# EAGLE design Boom_Control_Board (EAGLE 9.5.2)
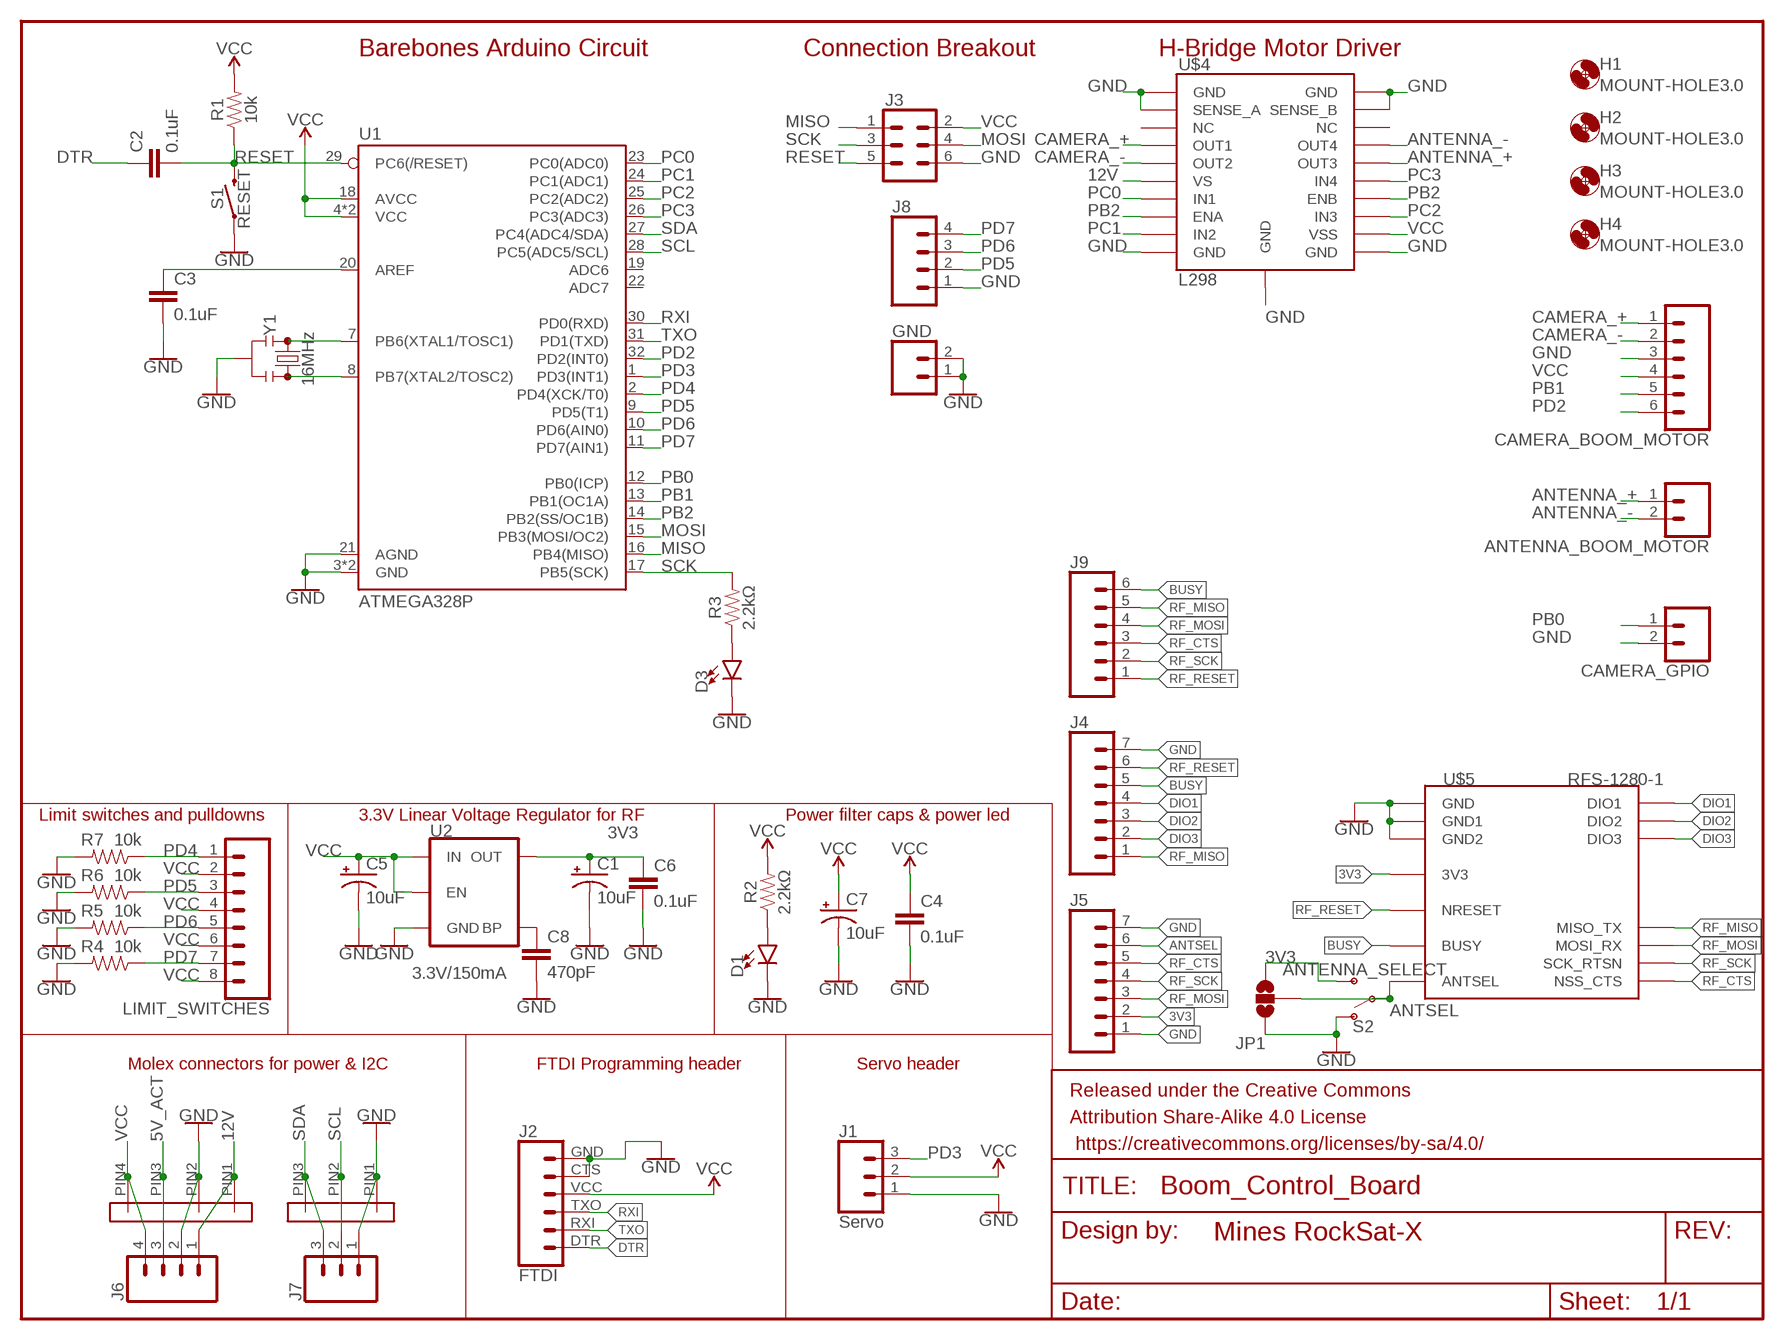
[diagram p0: schematic, sheet 1]

## Parts
ANTENNA_BOOM_MOTOR  CONN_02LOCK_LONGPADS  [1X02_LOCK_LONGPADS]
C1  10uF  10UF-POLAR-EIA3216-16V-10%(TANT)  [EIA3216]
C2  0.1uF  2.2UF-0805-25V-(+80/-20%)  [0805]
C3  0.1uF  2.2UF-0805-25V-(+80/-20%)  [0805]
C4  0.1uF  2.2UF-0805-25V-(+80/-20%)  [0805]
C5  10uF  10UF-POLAR-EIA3216-16V-10%(TANT)  [EIA3216]
C6  0.1uF  2.2UF-0805-25V-(+80/-20%)  [0805]
C7  10uF  10UF-POLAR-EIA3216-16V-10%(TANT)  [EIA3216]
C8  470pF  CAP-0805  [0805]
CAMERA_BOOM_MOTOR  CONN_06LOCK_LONGPADS  [1X06_LOCK_LONGPADS]
CAMERA_GPIO  CONN_02LOCK_LONGPADS  [1X02_LOCK_LONGPADS]
D1  LED-GREEN1206  [LED-1206]
D3  LED-GREEN1206  [LED-1206]
FRAME1  FRAME-LETTERNO_PACKAGE  [DUMMY]
GND  CONN_02LOCK_LONGPADS  [1X02_LOCK_LONGPADS]
H1  MOUNT-HOLE3.0  [3,0]
H2  MOUNT-HOLE3.0  [3,0]
H3  MOUNT-HOLE3.0  [3,0]
H4  MOUNT-HOLE3.0  [3,0]
J1  Servo  CONN_03  [1X03]
J2  FTDI  6_PIN_SERIAL_CABLEPTH  [FTDI_BASIC]
J3  CONN_03X22X3_SILK_MALE_PTH  [2X3]
J4  CONN_07LOCK  [1X07_LOCK]
J5  CONN_07LOCK  [1X07_LOCK]
J6  CONN_04LOCK  [1X04_LOCK]
J7  CONN_03  [1X03]
J8  CONN_04LOCK  [1X04_LOCK]
J9  CONN_06LOCK  [1X06_LOCK]
JP1  JUMPER-SMT_3_NO_NO_SILK  [SMT-JUMPER_3_0-NO_TRACE_NO-SILK]
LIMIT_SWITCHES  CONN_08LOCK_LONGPADS  [1X08_LOCK_LONGPADS]
R1  10k  RESISTOR0805  [0805]
R2  2.2kΩ  RESISTOR0805  [0805]
R3  2.2kΩ  RESISTOR0805  [0805]
R4  10k  RESISTOR0805  [0805]
R5  10k  RESISTOR0805  [0805]
R6  10k  RESISTOR0805  [0805]
R7  10k  RESISTOR0805  [0805]
S1  RESET  MOMENTARY-SWITCH-SPST-SMD-5.2-REDUNDANT  [TACTILE_SWITCH_SMD_5.2MM]
S2  ANTENNA_SELECT  SWITCH-SPDT-PTH-11.6X4.0MM  [SWITCH_SPDT_PTH_11.6X4.0MM]
U1  ATMEGA328P  ATMEGA328P_TQFP  [TQFP32-08]
U2  3.3V/150mA  V_REG_MIC52053.3V  [SOT23-5]
U$1  MOLEX_4PIN  [MOLEX_4PIN]
U$2  MOLEX_3PIN  [MOLEX_3PIN]
U$4  L298  L298_SMD_W_PAD  [POWERSO20_L298_PAD]
U$5  RFS-1280-1  [RFS-1280-1]
Y1  16MHz  RESONATOR-16MHZSMD_3.2X1.3  [RESONATOR-SMD-3.2X1.3]

## Nets
3V3: C1.+ C6.1 J5.2 JP1.3 S2.3(S) U2.5(OUT) U$5.P$9(3V3) U$5.P$23(3V3)
5V_ACT: J6.3 U$1.PIN3
12V: J6.1 U$1.PIN1 U$4.6(VS)
ANTENNA_+: ANTENNA_BOOM_MOTOR.1 U$4.16(OUT3)
ANTENNA_-: ANTENNA_BOOM_MOTOR.2 U$4.17(OUT4)
ANTSEL: J5.6 JP1.2 S2.2(P) U$5.P$13(ANTSEL) U$5.P$27(ANTSEL)
BUSY: J4.5 J9.6 U$5.P$3(BUSY) U$5.P$17(BUSY)
CAMERA_+: CAMERA_BOOM_MOTOR.1 U$4.4(OUT1)
CAMERA_-: CAMERA_BOOM_MOTOR.2 U$4.5(OUT2)
DIO1: J4.4 U$5.P$4(DIO1) U$5.P$18(DIO1)
DIO2: J4.3 U$5.P$5(DIO2) U$5.P$19(DIO2)
DIO3: J4.2 U$5.P$6(DIO3) U$5.P$20(DIO3)
DTR: C2.1 J2.DTR
GND: C1.- C3.2 C4.2 C5.- C6.2 C7.- C8.2 CAMERA_BOOM_MOTOR.3 CAMERA_GPIO.2 D1.C D3.C GND.1 GND.2 J1.1 J2.CTS J2.GND J3.6 J4.7 J5.1 J5.7 J6.2 J7.1 J8.1 JP1.1 R4.2 R5.2 R6.2 R7.2 S1.1 S1.2 S2.1(O) U1.3(GND) U1.5(GND) U1.21(AGND) U2.2(GND) U$1.PIN2 U$2.PIN1 U$4.1(GND) U$4.2(SENSE_A) U$4.10(GND) U$4.11(GND) U$4.19(SENSE_B) U$4.20(GND) U$4.PAD(GND) U$5.P$1(GND) U$5.P$8(GND1) U$5.P$14(GND2) U$5.P$15(GND) U$5.P$22(GND1) U$5.P$28(GND2) Y1.2
MISO: J3.1 U1.16(PB4(MISO))
MOSI: J3.4 U1.15(PB3(MOSI/OC2))
N$2: U1.7(PB6(XTAL1/TOSC1)) Y1.1
N$3: U1.8(PB7(XTAL2/TOSC2)) Y1.3
N$4: C3.1 U1.20(AREF)
N$5: D1.A R2.1
N$7: D3.A R3.1
N$8: C8.1 U2.4(BP)
PB0: CAMERA_GPIO.1 U1.12(PB0(ICP))
PB1: CAMERA_BOOM_MOTOR.5 U1.13(PB1(OC1A))
PB2: U1.14(PB2(SS/OC1B)) U$4.8(ENA) U$4.14(ENB)
PC0: U1.23(PC0(ADC0)) U$4.7(IN1)
PC1: U1.24(PC1(ADC1)) U$4.9(IN2)
PC2: U1.25(PC2(ADC2)) U$4.13(IN3)
PC3: U1.26(PC3(ADC3)) U$4.15(IN4)
PD2: CAMERA_BOOM_MOTOR.6 U1.32(PD2(INT0))
PD3: J1.3 U1.1(PD3(INT1))
PD4: LIMIT_SWITCHES.1 R7.1 U1.2(PD4(XCK/T0))
PD5: J8.2 LIMIT_SWITCHES.3 R6.1 U1.9(PD5(T1))
PD6: J8.3 LIMIT_SWITCHES.5 R5.1 U1.10(PD6(AIN0))
PD7: J8.4 LIMIT_SWITCHES.7 R4.1 U1.11(PD7(AIN1))
RESET: C2.2 J3.5 R1.1 S1.3 S1.4 U1.29(PC6(/RESET))
RF_CTS: J5.5 J9.3 U$5.P$12(NSS_CTS) U$5.P$26(NSS_CTS)
RF_MISO: J4.1 J9.5 U$5.P$7(MISO_TX) U$5.P$21(MISO_TX)
RF_MOSI: J5.3 J9.4 U$5.P$10(MOSI_RX) U$5.P$24(MOSI_RX)
RF_RESET: J4.6 J9.1 U$5.P$2(NRESET) U$5.P$16(NRESET)
RF_SCK: J5.4 J9.2 U$5.P$11(SCK_RTSN) U$5.P$25(SCK_RTSN)
RXI: J2.TXO U1.30(PD0(RXD))
SCK: J3.3 R3.2 U1.17(PB5(SCK))
SCL: J7.2 U1.28(PC5(ADC5/SCL)) U$2.PIN2
SDA: J7.3 U1.27(PC4(ADC4/SDA)) U$2.PIN3
TXO: J2.RXI U1.31(PD1(TXD))
VCC: C4.1 C5.+ C7.+ CAMERA_BOOM_MOTOR.4 J1.2 J2.VCC J3.2 J6.4 LIMIT_SWITCHES.2 LIMIT_SWITCHES.4 LIMIT_SWITCHES.6 LIMIT_SWITCHES.8 R1.2 R2.2 U1.4(VCC) U1.6(VCC) U1.18(AVCC) U2.1(IN) U2.3(EN) U$1.PIN4 U$4.12(VSS)
Unconnected: U1.19(ADC6) U1.22(ADC7) U$4.3(NC) U$4.18(NC)

## Notes on the sheet
- Barebones Arduino Circuit | Connection Breakout | H-Bridge Motor Driver
- Limit switches and pulldowns | 3.3V Linear Voltage Regulator for RF | Power filter caps & power led
- Molex connectors for power & I2C | FTDI Programming header | Servo header

## Library data of the parts
ANTENNA_BOOM_MOTOR CAMERA_GPIO GND = SparkFun-Connectors:CONN_02: Multi connection point. Often used as Generic Header-pin footprint for 0.1 inch spaced/style header connections On any of the 0.1 inch spaced packages, you can populate with these: Break Away Headers - Straight <https://www.sparkfun.com/products/116> (PRT-00116) Break Away Male Headers - Right Angle <https://www.sparkfun.com/products/553> (PRT-00553) Female Headers <https://www.sparkfun.com/products/115> (PRT-00115) Break Away Headers - Machine Pin <https://www.sparkfun.com/products/117> (PRT-00117) Break Away Female Headers - Swiss Machine Pin <https://www.sparkfun.com/products/743> (PRT-00743) For SCREWTERMINALS and SPRING TERMINALS visit here: Screw Terimnals on SparkFun.com <https://www.sparkfun.com/search/results?term=Screw+Terminals> (5mm/3.5mm/2.54mm spacing) This device is also useful as a general connection point to wire up your design to another part of your project. Our various solder wires solder well into these plated through hole pads. Hook-Up Wire - Assortment (Stranded, 22 AWG) <https://www.sparkfun.com/products/11375> (PRT-11375) Hook-Up Wire - Assortment (Solid Core, 22 AWG) <https://www.sparkfun.com/products/11367> (PRT-11367) View the entire wire category on our website here <https://www.sparkfun.com/categories/141> Special notes: Molex polarized connector foot print use with: PRT-08233 with associated crimp pins and housings. 2.54_SCREWTERM for use with PRT-10571. 3.5mm Screw Terminal footprints for PRT-08084 5mm Screw Terminal footprints for use with PRT-08432
C1 C5 C7 = SparkFun-Capacitors:10UF-POLAR: 10.0µF polarized capacitors A capacitor is a passive two-terminal electrical component used to store electrical energy temporarily in an electric field.; PROD_ID: CAP-00811
C2-C4 C6 = SparkFun-Capacitors:2.2UF: 2.2µF ceramic capacitors A capacitor is a passive two-terminal electrical component used to store electrical energy temporarily in an electric field.; PROD_ID: CAP-11624; VALUE: 2.2uF
C8 = SparkFun-Capacitors:CAP
CAMERA_BOOM_MOTOR J9 = SparkFun-Connectors:CONN_06: Multi connection point. Often used as Generic Header-pin footprint for 0.1 inch spaced/style header connections On any of the 0.1 inch spaced packages, you can populate with these: Break Away Headers - Straight <https://www.sparkfun.com/products/116> (PRT-00116) Break Away Male Headers - Right Angle <https://www.sparkfun.com/products/553> (PRT-00553) Female Headers <https://www.sparkfun.com/products/115> (PRT-00115) Break Away Headers - Machine Pin <https://www.sparkfun.com/products/117> (PRT-00117) Break Away Female Headers - Swiss Machine Pin <https://www.sparkfun.com/products/743> (PRT-00743) Arduino Stackable Header - 6 Pin <https://www.sparkfun.com/products/9280> (PRT-09280) For SCREWTERMINALS and SPRING TERMINALS visit here: Screw Terimnals on SparkFun.com <https://www.sparkfun.com/search/results?term=Screw+Terminals> (5mm/3.5mm/2.54mm spacing) This device is also useful as a general connection point to wire up your design to another part of your project. Our various solder wires solder well into these plated through hole pads. Hook-Up Wire - Assortment (Stranded, 22 AWG) <https://www.sparkfun.com/products/11375> (PRT-11375) Hook-Up Wire - Assortment (Solid Core, 22 AWG) <https://www.sparkfun.com/products/11367> (PRT-11367) View the entire wire category on our website here <https://www.sparkfun.com/categories/141>
D1 D3 = SparkFun-LED:LED-GREEN: Green SMD LED Used in manufacturing of various products at SparkFun Packages: 0603 - SMD 0603 package [Product Link] <http://www.futureelectronics.com/en/technologies/semiconductors/optoelectronics/leds/Pages/9894312-LTST-C190GKT.aspx?CrossPart=HSMG-C190&IM=0> LilyPad 1206 - SMD1206 LilyPad package [Product Link] <http://www.futureelectronics.com/en/Technologies/Product.aspx?ProductID=IN150NGHARVATEKCORPORATION2049943&IM=0> 1206 - SMD1206 package [Product Link] <http://www.futureelectronics.com/en/technologies/semiconductors/optoelectronics/leds/Pages/8315665-LTST-C150KGKT.aspx?IM=0> 1206 Bottom Mount -SMD 1206 Bottom Mount [Product Link] <http://www.digikey.com/product-detail/en/lite-on-inc/LTST-C230KGKT/160-1456-1-ND/386854> SparkFun Products: Pro Mini 328 -5V <https://www.sparkfun.com/products/821> RedBoard <https://www.sparkfun.com/products/12757> MP3 Trigger <https://www.sparkfun.com/products/13720> Makey Makey <https://www.sparkfun.com/products/11076>; PROD_ID: DIO-00862; VALUE: GREEN
FRAME1 = SparkFun-Aesthetics:FRAME-LETTER: Schematic Frame - Letter Standard 8.5x11 US Letter frame; DESIGNER: Mines RockSat-X; VERSION: 1
H1-H4 = holes:MOUNT-HOLE: MOUNTING HOLE with drill center marker
J1 J7 = SparkFun-Connectors:CONN_03: Multi connection point. Often used as Generic Header-pin footprint for 0.1 inch spaced/style header connections On any of the 0.1 inch spaced packages, you can populate with these: Break Away Headers - Straight <https://www.sparkfun.com/products/116> (PRT-00116) Break Away Male Headers - Right Angle <https://www.sparkfun.com/products/553> (PRT-00553) Female Headers <https://www.sparkfun.com/products/115> (PRT-00115) Break Away Headers - Machine Pin <https://www.sparkfun.com/products/117> (PRT-00117) Break Away Female Headers - Swiss Machine Pin <https://www.sparkfun.com/products/743> (PRT-00743) Stackable Header - 3 Pin (Female, 0.1") <https://www.sparkfun.com/products/13875> (PRT-13875) For SCREWTERMINALS and SPRING TERMINALS visit here: Screw Terimnals on SparkFun.com <https://www.sparkfun.com/search/results?term=Screw+Terminals> (5mm/3.5mm/2.54mm spacing) This device is also useful as a general connection point to wire up your design to another part of your project. Our various solder wires solder well into these plated through hole pads. Hook-Up Wire - Assortment (Stranded, 22 AWG) <https://www.sparkfun.com/products/11375> (PRT-11375) Hook-Up Wire - Assortment (Solid Core, 22 AWG) <https://www.sparkfun.com/products/11367> (PRT-11367) View the entire wire category on our website here <https://www.sparkfun.com/categories/141> Special notes: Molex polarized connector foot print use with SKU : PRT-08232 with associated crimp pins and housings.; PROD_ID: XXX-00000; VALUE: 455-1750-1-ND
J2 = SparkFun-Connectors:6_PIN_SERIAL_CABLE: 6-pin header connection for use with the "FTDI BASIC" pinout - CABLE SIDE. Also known as "Arduino Serial Program Header". This is used on a design to provide a 6-pin connection point for serial communication usually from a USB cable (D+/D-) to these headers (RX/TX). It also has the remaining pins necessary for programming in the Arduino evironment (DTR, GND, and sometimes VCC). Note, this device has "CABLE" in the name. It is intended to be used on a design that usually lives on the end of your USB cable and prvides the converter chip (FTDI232 or FTDI231x) to commnicate serial RX/TX. The "sister" device, named "TARGET" is inteneded to be used on a design that contains a target micro-controller that you wish to program. You can populate with some of these: Female Headers <https://www.sparkfun.com/products/115> (PRT-00115) For reference (or to suit your programming needs) check out these designs: SparkFun FTDI Basic Breakout - 5V <https://www.sparkfun.com/products/9716> (DEV-09716) SparkFun FTDI Basic Breakout - 3.3V <https://www.sparkfun.com/products/9873> (DEV-09873) SparkFun FTDI SmartBasic <https://www.sparkfun.com/products/12935> (DEV-12935) SparkFun Beefy 3 - FTDI Basic Breakout <https://www.sparkfun.com/products/13746> (DEV-13746)
J3 = SparkFun-Connectors:CONN_03X2: Multi connection point. Often used as Generic Header-pin footprint for 0.1 inch spaced/style header connections You can populate with any combo of single row headers, but if you'd like an exact match, check these: Header - 2x3 (Male, 0.1") <https://www.sparkfun.com/products/12807> (PRT-12807) Header - 2x3 (Female, 0.1") <https://www.sparkfun.com/products/13010> (PRT-13010) 2x3 Pin Shrouded Header <https://www.sparkfun.com/products/10877> (PRT-10877) On any of the 0.1 inch spaced packages, you can populate with these: Break Away Headers - Straight <https://www.sparkfun.com/products/116> (PRT-00116) Break Away Male Headers - Right Angle <https://www.sparkfun.com/products/553> (PRT-00553) Female Headers <https://www.sparkfun.com/products/115> (PRT-00115) Break Away Headers - Machine Pin <https://www.sparkfun.com/products/117> (PRT-00117) Break Away Female Headers - Swiss Machine Pin <https://www.sparkfun.com/products/743> (PRT-00743) Special note: the shrouded connector mates well with our 3x2 ribbon cables: Ribbon Crimp Connector - 6-pin (2x3, Female) <https://www.sparkfun.com/products/10651> (PRT-10651) Ribbon Cable - 6 wire (15ft) <https://www.sparkfun.com/products/10646> (PRT-10646); PROD_ID: CONN-09701
J4 J5 = SparkFun-Connectors:CONN_07: Multi connection point. Often used as Generic Header-pin footprint for 0.1 inch spaced/style header connections On any of the 0.1 inch spaced packages, you can populate with these: Break Away Headers - Straight <https://www.sparkfun.com/products/116> (PRT-00116) Break Away Male Headers - Right Angle <https://www.sparkfun.com/products/553> (PRT-00553) Female Headers <https://www.sparkfun.com/products/115> (PRT-00115) Break Away Headers - Machine Pin <https://www.sparkfun.com/products/117> (PRT-00117) Break Away Female Headers - Swiss Machine Pin <https://www.sparkfun.com/products/743> (PRT-00743) For SCREWTERMINALS and SPRING TERMINALS visit here: Screw Terimnals on SparkFun.com <https://www.sparkfun.com/search/results?term=Screw+Terminals> (5mm/3.5mm/2.54mm spacing) This device is also useful as a general connection point to wire up your design to another part of your project. Our various solder wires solder well into these plated through hole pads. Hook-Up Wire - Assortment (Stranded, 22 AWG) <https://www.sparkfun.com/products/11375> (PRT-11375) Hook-Up Wire - Assortment (Solid Core, 22 AWG) <https://www.sparkfun.com/products/11367> (PRT-11367) View the entire wire category on our website here <https://www.sparkfun.com/categories/141> Special notes: Molex polarized connector foot print use with SKU : PRT-08231 with associated crimp pins and housings. 1MM SMD Version SKU: PRT-10208 NOTES ON THE VARIANTS LOCK and LOCK_LONGPADS... This footprint was designed to help hold the alignment of a through-hole component (i.e. 6-pin header) while soldering it into place. You may notice that each hole has been shifted either up or down by 0.005 of an inch from it's more standard position (which is a perfectly straight line). This slight alteration caused the pins (the squares in the middle) to touch the edges of the holes. Because they are alternating, it causes a "brace" to hold the component in place. 0.005 has proven to be the perfect amount of "off-center" position when using our standard breakaway headers. Although looks a little odd when you look at the bare footprint, once you have a header in there, the alteration is very hard to notice. Also,if you push a header all the way into place, it is covered up entirely on the bottom side.
J6 J8 = SparkFun-Connectors:CONN_04: Multi connection point. Often used as Generic Header-pin footprint for 0.1 inch spaced/style header connections On any of the 0.1 inch spaced packages, you can populate with these: Break Away Headers - Straight <https://www.sparkfun.com/products/116> (PRT-00116) Break Away Male Headers - Right Angle <https://www.sparkfun.com/products/553> (PRT-00553) Female Headers <https://www.sparkfun.com/products/115> (PRT-00115) Break Away Headers - Machine Pin <https://www.sparkfun.com/products/117> (PRT-00117) Break Away Female Headers - Swiss Machine Pin <https://www.sparkfun.com/products/743> (PRT-00743) For SCREWTERMINALS and SPRING TERMINALS visit here: Screw Terimnals on SparkFun.com <https://www.sparkfun.com/search/results?term=Screw+Terminals> (5mm/3.5mm/2.54mm spacing) This device is also useful as a general connection point to wire up your design to another part of your project. Our various solder wires solder well into these plated through hole pads. Hook-Up Wire - Assortment (Stranded, 22 AWG) <https://www.sparkfun.com/products/11375> (PRT-11375) Hook-Up Wire - Assortment (Solid Core, 22 AWG) <https://www.sparkfun.com/products/11367> (PRT-11367) View the entire wire category on our website here <https://www.sparkfun.com/categories/141> Special notes: Molex polarized connector foot print use with SKU : PRT-08231 with associated crimp pins and housings. 1MM SMD Version SKU: PRT-10208; PROD_ID: CONN-09696
JP1 = SparkFun-Jumpers:JUMPER-SMT_3_NO: Normally open jumper This jumper has three pads in close proximity to each other. Apply solder to close the connection(s).
LIMIT_SWITCHES = SparkFun-Connectors:CONN_08: Multi connection point. Often used as Generic Header-pin footprint for 0.1 inch spaced/style header connections On any of the 0.1 inch spaced packages, you can populate with these: Break Away Headers - Straight <https://www.sparkfun.com/products/116> (PRT-00116) Break Away Male Headers - Right Angle <https://www.sparkfun.com/products/553> (PRT-00553) Female Headers <https://www.sparkfun.com/products/115> (PRT-00115) Break Away Headers - Machine Pin <https://www.sparkfun.com/products/117> (PRT-00117) Break Away Female Headers - Swiss Machine Pin <https://www.sparkfun.com/products/743> (PRT-00743) Arduino Stackable Header - 8 Pin <https://www.sparkfun.com/products/9279> (PRT-09279) For SCREWTERMINALS and SPRING TERMINALS visit here: Screw Terimnals on SparkFun.com <https://www.sparkfun.com/search/results?term=Screw+Terminals> (5mm/3.5mm/2.54mm spacing) This device is also useful as a general connection point to wire up your design to another part of your project. Our various solder wires solder well into these plated through hole pads. Hook-Up Wire - Assortment (Stranded, 22 AWG) <https://www.sparkfun.com/products/11375> (PRT-11375) Hook-Up Wire - Assortment (Solid Core, 22 AWG) <https://www.sparkfun.com/products/11367> (PRT-11367) View the entire wire category on our website here <https://www.sparkfun.com/categories/141> Special notes: Molex polarized connector foot print use with SKU : PRT-08231 with associated crimp pins and housings. 1MM SMD Version SKU: PRT-10208 NOTES ON THE VARIANTS LOCK and LOCK_LONGPADS... This footprint was designed to help hold the alignment of a through-hole component (i.e. 6-pin header) while soldering it into place. You may notice that each hole has been shifted either up or down by 0.005 of an inch from it's more standard position (which is a perfectly straight line). This slight alteration caused the pins (the squares in the middle) to touch the edges of the holes. Because they are alternating, it causes a "brace" to hold the component in place. 0.005 has proven to be the perfect amount of "off-center" position when using our standard breakaway headers. Although looks a little odd when you look at the bare footprint, once you have a header in there, the alteration is very hard to notice. Also,if you push a header all the way into place, it is covered up entirely on the bottom side.
R1-R7 = SparkFun-Resistors:RESISTOR: Generic Resistor Package
S1 = SparkFun-Switches:MOMENTARY-SWITCH-SPST: Momentary Switch (Pushbutton) - SPST Normally-open (NO) SPST momentary switches (buttons, pushbuttons). Variants PTH-12MM - 12mm square, through-hole Momentary Pushbutton Switch - 12mm Square <https://www.sparkfun.com/products/9190> (COM-09190) PTH-6.0MM, PTH-6.0MM-KIT - 6.0mm square, through-hole Mini Pushbutton Switch <https://www.sparkfun.com/products/97> (COM-00097) KIT package intended for soldering kit's - only one side of pads' copper is exposed. PTH-RIGHT-ANGLE-KIT - Right-angle, through-hole Right Angle Tactile Button <https://www.sparkfun.com/products/10791> - Used on SparkFun BigTime Watch Kit <https://www.sparkfun.com/products/11734> SMD-12MM - 12mm square, surface-mount Tactile Button - SMD (12mm) <https://www.sparkfun.com/products/12993> (COM-12993) Used on SparkFun PicoBoard <https://www.sparkfun.com/products/11888> SMD-4.5MM - 4.5mm Square Trackball Switch Used on SparkFun Blackberry Trackballer Breakout <https://www.sparkfun.com/products/13169> SMD-4.6MMX2.8MM - 4.60mm x 2.80mm, surface mount Used on SparkFun SAMD21 Mini Breakout <https://www.sparkfun.com/products/13664> SMD-5.2MM, SMD-5.2-REDUNDANT - 5.2mm square, surface-mount Mini Pushbutton Switch - SMD <https://www.sparkfun.com/products/8720> (COM-08720) Used on Arduino Pro Mini <https://www.sparkfun.com/products/11114> REDUNDANT package connects both switch circuits together SMD-6.0X3.5MM - 6.0 x 3.5mm, surface mount Momentary Reset Switch SMD <https://www.sparkfun.com/products/8229> (COM-08229) SMD-6.2MM-TALL - 6.2mm square, surface mount Tactile Button - SMD (6mm) <https://www.sparkfun.com/products/12992> Used on SparkFun Digital Sandbox <https://www.sparkfun.com/products/12651> SMD-RIGHT-ANGLE - Right-angle, surface mount Used on SparkFun Block for Intel® Edison - Arduino <https://www.sparkfun.com/products/13036>; PROD_ID: SWCH-08247; SF_SKU: COM-08720
S2 = SparkFun-Switches:SWITCH-SPDT: Single Pole, Double Throw (SPDT) Switch Single-pole, double-throw (SPDT) switch. Variant Overview SMD-AYZ0202 Surface Mount DPDT Switch <https://www.sparkfun.com/products/597> (COM-00597) Used on e.g. LilyPad Arduino USB - ATmega32U4 Board <https://www.sparkfun.com/products/12049> PTH-11.6X4.0MM SPDT Mini Power Switch <https://www.sparkfun.com/products/102> (COM-00102) Used on e.g. SparkFun Simon Says - Through-Hole Soldering Kit <https://www.sparkfun.com/products/10547> (KIT-10547) PTH-11.6X4.0MM-KIT KIT version of SPDT Mini Power Switch - Simplifies soldering by removing tStop of switch pins - only one side can be soldered. PTH-11.6X4.0MM-LOCK LOCK version of SPDT Mini Power Switch - Offset pins hold switch in place for easier soldering. SMD-RIGHT-ANGLE Surface Mount Right Angle Switch <https://www.sparkfun.com/products/10860> (COM-10860) Used on e.g. SparkFun ESP8266 Thing <https://www.sparkfun.com/products/13231>; PROD_ID: SWCH-08261; SF_SKU: COM-00102
U1 = SparkFun-IC-Microcontroller:ATMEGA328P_TQFP: Popular 328P in QFP Storefront component: ATmega328 - TQFP <https://www.sparkfun.com/products/13448> (COM-13448) Datasheet <http://www.sparkfun.com/datasheets/Components/SMD/ATMega328.pdf> SparkFun Products SparkFun RedBoard - Programmed with Arduino <https://www.sparkfun.com/products/12757> (DEV-12757) Arduino Pro Mini 328 - 5V/16MHz <https://www.sparkfun.com/products/11113> (DEV-11113) Arduino Pro Mini 328 - 3.3V/8MHz <https://www.sparkfun.com/products/11114> (DEV-11114) SparkFun OpenLog <https://www.sparkfun.com/products/13712> (DEV-13712) SparkFun MicroView - OLED Arduino Module <https://www.sparkfun.com/products/12923> (DEV-12923) SparkFun Digital Sandbox <https://www.sparkfun.com/products/12651> (DEV-12651) SparkFun PicoBoard <https://www.sparkfun.com/products/11888> (WIG-11888) Arduino Fio <https://www.sparkfun.com/products/10116> (DEV-10116) LilyPad Arduino 328 Main Board <https://www.sparkfun.com/products/13342> (DEV-13342) SparkFun RedStick <https://www.sparkfun.com/products/13741> (DEV-13741) LilyPad MP3 <https://www.sparkfun.com/products/11013> (DEV-11013) LilyPad Arduino SimpleSnap <https://www.sparkfun.com/products/10941> (DEV-10941) SparkFun Stepoko <https://www.sparkfun.com/products/13899> (ROB-13899) SparkFun Geiger Counter <https://www.sparkfun.com/products/11345> (SEN-11345) SparkFun EL Sequencer <https://www.sparkfun.com/products/12781> (COM-12781) Arduino Pro 328 - 5V/16MHz <https://www.sparkfun.com/products/10915> (DEV-10915) CryptoCape <https://www.sparkfun.com/products/12773> (DEV-12773) SparkFun IR Thermometer Evaluation Board - MLX90614 <https://www.sparkfun.com/products/10740> (SEN-10740) SparkFun RedBot Mainboard <https://www.sparkfun.com/products/12097> (ROB-12097) Arduino Pro 328 - 3.3V/8MHz <https://www.sparkfun.com/products/10914> (DEV-10914) SparkFun Block for Intel® Edison - Arduino <https://www.sparkfun.com/products/13036> (DEV-13036) SparkFun Simon Says - Surface Mount Soldering Kit <https://www.sparkfun.com/products/10935> (KIT-10935) SparkFun 7-Segment Serial Display - Red <https://www.sparkfun.com/products/11441> (COM-11441) SparkFun 7-Segment Serial Display - White <https://www.sparkfun.com/products/11629> (COM-11629) SparkFun 7-Segment Serial Display - Yellow <https://www.sparkfun.com/products/11443> (COM-11443) SparkFun 7-Segment Serial Display - Kelly Green <https://www.sparkfun.com/products/11440> (COM-11440) SparkFun 7-Segment Serial Display - Blue <https://www.sparkfun.com/products/11442> (COM-11442) SparkFun OpenSegment Serial Display - 20mm (Blue) <https://www.sparkfun.com/products/11647> (COM-11647) SparkFun OpenSegment Serial Display - 20mm (Green) <https://www.sparkfun.com/products/11646> (COM-11646) SparkFun OpenSegment Serial Display - 20mm (White) <https://www.sparkfun.com/products/11648> (COM-11648) SparkFun OpenSegment Serial Display - 20mm (Red) <https://www.sparkfun.com/products/11644> (COM-11644) SparkFun OpenSegment Serial Display - 20mm (Yellow) <https://www.sparkfun.com/products/11645> (COM-11645) SparkFun OpenSegment Shield <https://www.sparkfun.com/products/13190> (DEV-13190); PROD_ID: IC-09069; VALUE: ATMEGA328P_TQFP
U2 = SparkFun-IC-Power:V_REG_MIC5205: V_REG MIC5205 Standard 3.3V, 5V, and Adjustable 150mA LDO voltage regulator in SOT-23 layout. Micrel part MIC5205. BP (by-pass) pin is used to lower output noise with 470pF cap, may be left open. On the adjustable version BP is used to set output.; PROD_ID: VREG-00822
U$1 = PowerManagementParts:MOLEX_4PIN
U$2 = PowerManagementParts:MOLEX_3PIN
U$4 = SparkFun-IC-Special-Function:L298_SMD_W_PAD: Full-bridge power driver IC This device uses the ground pad under the IC; PROD_ID: IC-09133
U$5 = PowerManagementParts:RFS-1280-1
Y1 = SparkFun-Clocks:RESONATOR-16MHZ: 16MHz Resonator Digikey Example <http://www.digikey.com/product-detail/en/murata-electronics-north-america/CSTCE16M0V53-R0/490-1198-1-ND/584635> Frequency: 16MHz Frequency Stability: ±0.3% Frequency Tolerance: ±0.5% Capacitance: 15pF SparkFun Products SparkFun OpenLog <https://www.sparkfun.com/products/13712> SparkFun MicroView - OLED Arduino Module <https://www.sparkfun.com/products/12923>; PROD_ID: XTAL-08900

## Board
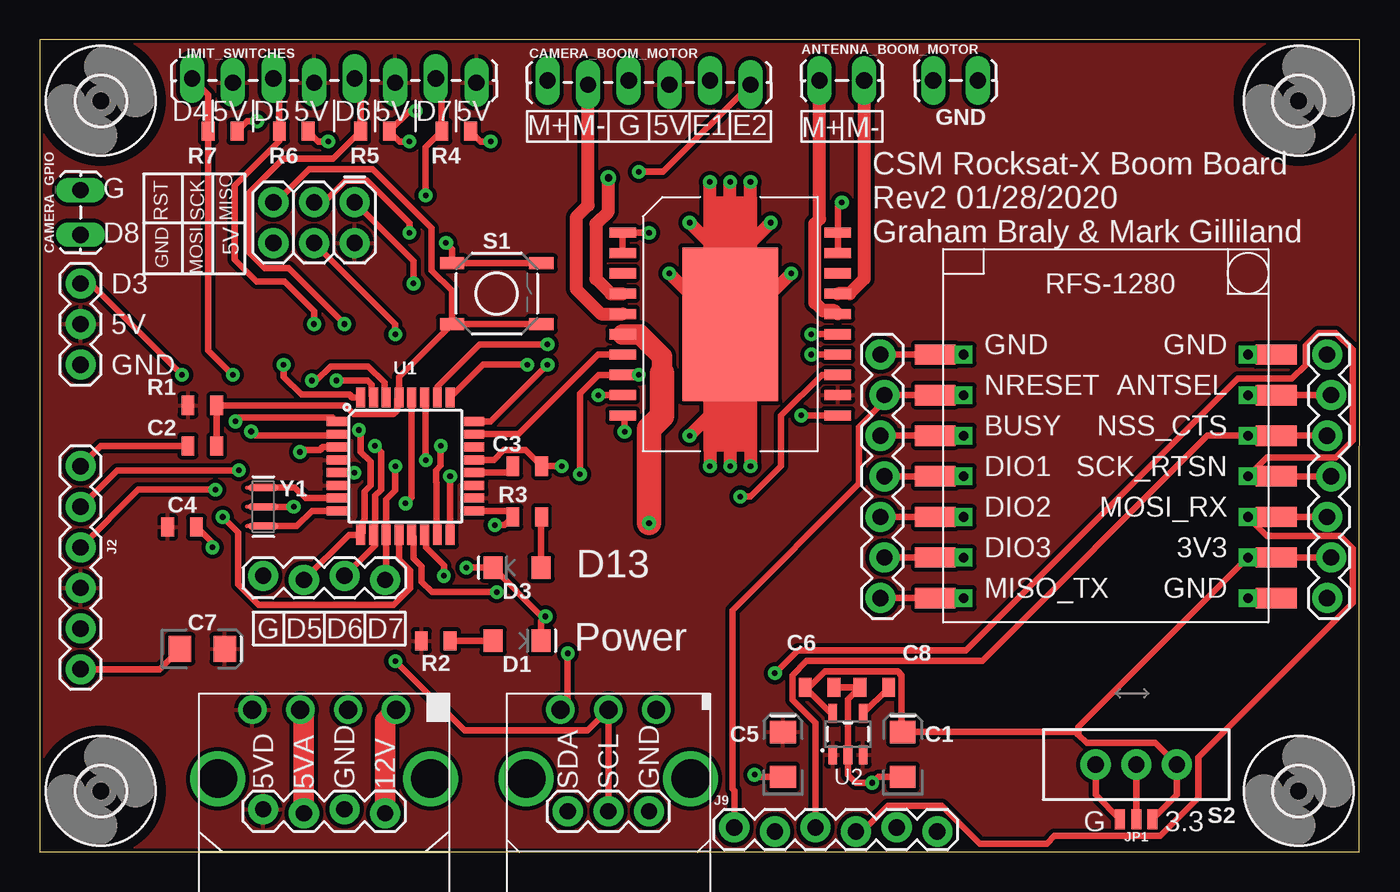
[diagram p1: board, top side]
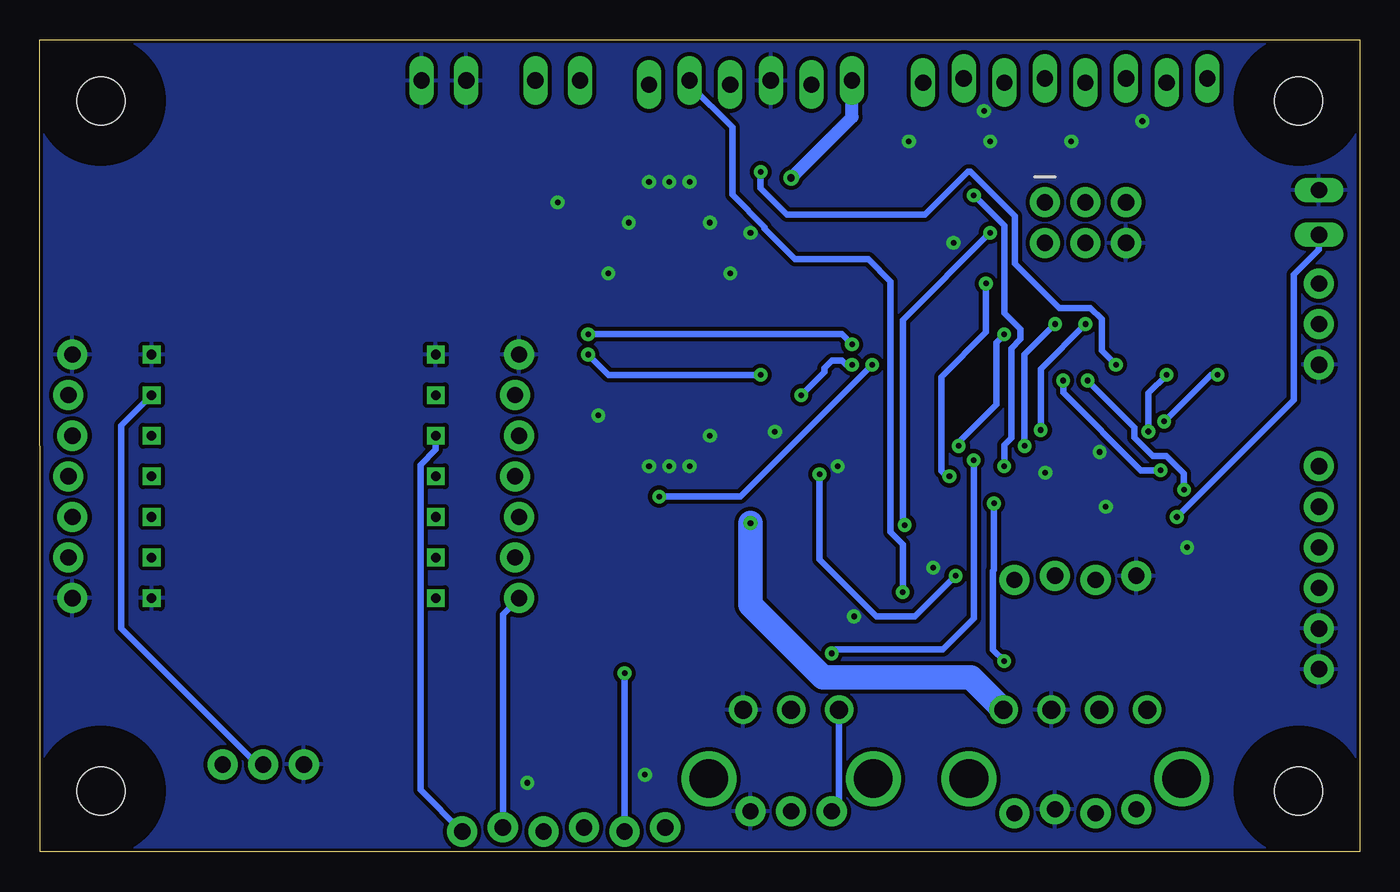
[diagram p2: board, bottom side, seen from below]

Size 82.55 x 50.8 mm. Coordinates in mm from the lower left corner, seen from the top.
Outline: 0,0 82.53,0 82.55,50.8 0,50.8 0,0
Copper layers (1*16): Top 0.035mm / dielectric 1.5mm / Bottom 0.035mm
Design rules "SparkFun-2-layer-STANDARD_13milDrill": minimum track width 10mil, minimum drill 13mil, track to track 10mil, track to pad 8mil, pad to pad 8mil, via to via 10mil, smd to smd 8mil, copper to edge 8mil, drill to drill 8mil, minimum pad ring 10mil, minimum via ring 10mil, stop-mask expansion 4mil, vias tented up to drill 25mil, thermal gap 10mil

### Footprints (pad centres in the part's own frame; a part is rotated, then mirrored left to right if it is on the bottom)
1X02_LOCK_LONGPADS = drill 1.016 long: 1 -0.127,0; 2 2.667,0
EIA3216 = smd 1.4 x 1.6: + 1.4,0; - -1.4,0
0805 = smd 0.8 x 1.2: 1 -0.9,0; 2 0.9,0
1X06_LOCK_LONGPADS = drill 1.016 long: 1 0,0; 2 2.54,-0.254; 3 5.08,0; 4 7.62,-0.254; 5 10.16,0; 6 12.7,-0.254
LED-1206 = smd 1.2 x 1.4: A -1.5,0; C 1.5,0
3,0 = hole 3: 0,0
1X03 = drill 1.016 pad 1.88: 1 0,0; 2 2.54,0; 3 5.08,0
FTDI_BASIC = drill 1.016 pad 1.88: CTS 10.16,0; DTR 0,0; GND 12.7,0; RXI 2.54,0; TXO 5.08,0; VCC 7.62,0
2X3 = drill 1.016 pad 1.88: 1 0,0; 2 0,2.54; 3 2.54,0; 4 2.54,2.54; 5 5.08,0; 6 5.08,2.54
1X07_LOCK = drill 1.016 pad 1.88: 1 0,0.127; 2 2.54,-0.127; 3 5.08,0.127; 4 7.62,-0.127; 5 10.16,0.127; 6 12.7,-0.127; 7 15.24,0.127
1X04_LOCK = drill 1.016 pad 1.88: 1 0,0.127; 2 2.54,-0.127; 3 5.08,0.127; 4 7.62,-0.127
1X06_LOCK = drill 1.016 pad 1.88: 1 0,0; 2 2.54,-0.254; 3 5.08,0; 4 7.62,-0.254; 5 10.16,0; 6 12.7,-0.254
SMT-JUMPER_3_0-NO_TRACE_NO-SILK = smd 0.635 x 1.27: 1 -1.016,0; 2 0,0; 3 1.016,0
1X08_LOCK_LONGPADS = drill 1.016 long: 1 0,0.127; 2 2.54,-0.127; 3 5.08,0.127; 4 7.62,-0.127; 5 10.16,0.127; 6 12.7,-0.127; 7 15.24,0.127; 8 17.78,-0.127
TACTILE_SWITCH_SMD_5.2MM = smd 1.524 x 0.762: 1 -2.794,1.905; 2 2.794,1.905; 3 -2.794,-1.905; 4 2.794,-1.905
SWITCH_SPDT_PTH_11.6X4.0MM = drill 1.016 pad 1.88: 1 0,2.54; 2 0,0; 3 0,-2.54
TQFP32-08 = smd 1.27 x 0.559: 1 -4.293,2.8; 2 -4.293,2; 3 -4.293,1.2; 4 -4.293,0.4; 5 -4.293,-0.4; 6 -4.293,-1.2; 7 -4.293,-2; 8 -4.293,-2.8; 17 4.293,-2.8; 18 4.293,-2; 19 4.293,-1.2; 20 4.293,-0.4; 21 4.293,0.4; 22 4.293,1.2; 23 4.293,2; 24 4.293,2.8 | smd 0.559 x 1.27: 9 -2.8,-4.293; 10 -2,-4.293; 11 -1.2,-4.293; 12 -0.4,-4.293; 13 0.4,-4.293; 14 1.2,-4.293; 15 2,-4.293; 16 2.8,-4.293; 25 2.8,4.293; 26 2,4.293; 27 1.2,4.293; 28 0.4,4.293; 29 -0.4,4.293; 30 -1.2,4.293; 31 -2,4.293; 32 -2.8,4.293
SOT23-5 = smd 0.55 x 1.2: 1 -0.95,-1.3; 2 0,-1.3; 3 0.95,-1.3; 4 0.95,1.3; 5 -0.95,1.3
MOLEX_4PIN = drill 2.413: MH1 -6.655,-4.318; MH2 6.655,-4.318 | drill 1.118 pad 1.778: PIN1 4.496,0; PIN2 1.499,0; PIN3 -1.499,0; PIN4 -4.496,0
MOLEX_3PIN = drill 2.413: MH1 -5.144,-4.318; MH2 5.144,-4.318 | drill 1.118 pad 1.778: PIN1 2.997,0; PIN2 0,0; PIN3 -2.997,0
POWERSO20_L298_PAD = smd 1.651 x 0.635: 1 -6.731,5.715; 2 -6.731,4.445; 3 -6.731,3.175; 4 -6.731,1.905; 5 -6.731,0.635; 6 -6.731,-0.635; 7 -6.731,-1.905; 8 -6.731,-3.175; 9 -6.731,-4.445; 10 -6.731,-5.715; 11 6.731,-5.715; 12 6.731,-4.445; 13 6.731,-3.175; 14 6.731,-1.905; 15 6.731,-0.635; 16 6.731,0.635; 17 6.731,1.905; 18 6.731,3.175; 19 6.731,4.445; 20 6.731,5.715 | smd 5.994 x 9.601: PAD 0,0
RFS-1280-1 = drill 0.6 square: P$1 -8.89,5.08; P$2 -8.89,2.54; P$3 -8.89,0; P$4 -8.89,-2.54; P$5 -8.89,-5.08; P$6 -8.89,-7.62; P$7 -8.89,-10.16; P$8 8.89,-10.16; P$9 8.89,-7.62; P$10 8.89,-5.08; P$11 8.89,-2.54; P$12 8.89,0; P$13 8.89,2.54; P$14 8.89,5.08 | smd 2.54 x 1.27: P$15 -10.668,5.08; P$16 -10.668,2.54; P$17 -10.668,0; P$18 -10.668,-2.54; P$19 -10.668,-5.08; P$20 -10.668,-7.62; P$21 -10.668,-10.16; P$22 10.668,-10.16; P$23 10.668,-7.62; P$24 10.668,-5.08; P$25 10.668,-2.54; P$26 10.668,0; P$27 10.668,2.54; P$28 10.668,5.08
RESONATOR-SMD-3.2X1.3 = smd 0.45 x 1.905: 1 -1.2,0; 2 0,0; 3 1.2,0

### Placement (x,y rotation side)
ANTENNA_BOOM_MOTOR  48.9,48.26 0 top
C1  53.98,6.1 90 top
C2  10.16,25.4 0 top
C3  30.48,24.13 0 top
C4  8.89,20.32 0 top
C5  46.48,6.1 90 top
C6  48.77,10.29 0 top
C7  10.16,12.7 0 top
C8  52.2,10.29 180 top
CAMERA_BOOM_MOTOR  31.75,48.26 0 top
CAMERA_GPIO  2.54,38.73 90 top
D1  29.84,13.21 0 top
D3  29.84,17.78 180 top
FRAME1  0,0 0 top
GND  56.01,48.26 0 top
H1  3.81,3.81 0 top
H2  78.74,3.81 0 top
H3  3.81,46.99 0 top
H4  78.74,46.99 0 top
J1  2.54,30.48 90 top
J2  2.54,24.13 270 top
J3  19.68,40.64 180 top
J4  52.7,15.88 90 top
J5  80.64,15.88 90 top
J6  21.59,2.54 180 top
J7  38.1,2.54 180 top
J8  13.97,17.14 0 top
J9  43.43,1.52 0 top
JP1  68.58,2.03 0 top
LIMIT_SWITCHES  9.53,48.26 0 top
R1  10.16,27.94 180 top
R2  24.77,13.21 180 top
R3  30.48,20.95 180 top
R4  26.04,45.09 0 top
R5  20.95,45.09 0 top
R6  15.88,45.09 0 top
R7  11.43,45.09 0 top
S1  28.57,34.92 0 top
S2  68.58,5.46 90 top
U1  22.86,24.13 0 top
U2  50.55,7.37 0 top
U$1  17.78,8.89 0 top
U$2  35.56,8.89 0 top
U$4  43.18,33.02 0 top
U$5  66.67,26.04 0 top
Y1  13.97,21.59 270 top

### Tracks (layer width: path | path; a pad name or v marks a point on that pad's centre or on a via)
3V3
  Top 0.406: J5.2 U$5.P$23 U$5.P$9 64.97,7.82 64.97,7.32 | JP1.3 71.12,3.56 S2.3 69.77,6.81 65.48,6.81 64.97,7.32 | U2.5 49.49,8.67 C6.1 48.09,10.29 49.1,11.29 53.66,11.29 53.9,11.05 53.9,7.57 C1.+ 64.79,7.5 64.97,7.32
5V_ACT
  Top 1.27: U$1.PIN3 16.51,8.66 J6.3
12V  (via drill 0.35)
  Top 0.406: U$4.6 36.45,32.36
  Top 1.27: J6.1 21.59,8.2 U$1.PIN1 | 36.45,32.36 37.53,32.36 38.91,30.98 38.91,29.97
  Top 1.524: 38.91,29.97 38.91,27.26 38.1,26.45 v38.1,20.57
  Bottom 1.524: v38.1,20.57 38.1,15.45 33.57,10.92 24.31,10.92 U$1.PIN1
ANTENNA_+
  Top 0.813: U$4.16 49.71,33.86 48.97,33.86 48.48,34.35 48.48,39.3 48.77,39.6 ANTENNA_BOOM_MOTOR.1
ANTENNA_-
  Top 0.813: U$4.17 50.65,34.92 51.56,35.84 ANTENNA_BOOM_MOTOR.2
ANTSEL
  Top 0.406: U$5.P$13 U$5.P$27 J5.6 | S2.2 JP1.2
  Bottom 0.406: S2.2 68.96,5.46 77.47,13.97 77.47,26.67 U$5.P$13
BUSY
  Top 0.406: U$5.P$3 U$5.P$17 J4.5
  Bottom 0.406: U$5.P$3 57.78,25.18 58.74,24.22 58.74,3.88 J9.6
CAMERA_+  (via drill 0.45)
  Top 0.813: v35.56,42.16 35.56,40.07 34.78,39.29 34.78,35.85 35.71,34.92 U$4.4
  Bottom 0.813: v35.56,42.16 31.75,45.97 CAMERA_BOOM_MOTOR.1
CAMERA_-
  Top 0.813: CAMERA_BOOM_MOTOR.2 34.29,40.45 33.54,39.7 33.54,35.23 35.11,33.66 U$4.5
DIO1
  Top 0.406: U$5.P$4 U$5.P$18 J4.4
DIO2
  Top 0.406: U$5.P$5 U$5.P$19 J4.3
DIO3
  Top 0.406: U$5.P$6 U$5.P$20 J4.2
DTR
  Top 0.406: C2.1 3.81,25.4 J2.DTR
GND  (via drill 0.35)
  Top 0.406: S1.2 S1.1 25.78,37.72 v25.4,38.1 | v32.64,24.13 C3.2 30.37,25.14 29.01,25.14 28.41,24.53 U1.21 | v26.67,17.78 D3.C 31.39,14.73 v31.62,14.73 31.34,14.45 D1.C | R7.2 12.96,45.72 v13.59,45.72 | R6.2 17.41,44.45 v18.03,44.45 | v23.11,44.45 22.49,44.45 R5.2 23.12,46.35 v23.5,46.35 | R4.2 27.57,44.45 v28.19,44.45 | Y1.2 v15.88,21.59 | C7.- 7.49,11.43 J2.GND | C4.2 10.79,19.32 v10.79,19.05 | v38.1,38.73 U$4.1 U$4.2 | U$4.11 v47.62,27.3 | U$4.10 36.58,27.18 v36.58,26.29 | v50.16,40.64 49.91,40.39 U$4.20 U$4.19 | U$5.P$1 U$5.P$15 J4.7 | U$5.P$28 U$5.P$14 | U$5.P$22 U$5.P$8 | S2.1 66.04,3.56 JP1.1 | U1.3 17.69,25.33 17.51,25.15 16.39,25.15 v16.26,25.02 | U1.5 19.65,23.73 v19.66,23.72 | v44.7,4.83 44.83,4.7 C5.- | C1.- 52.45,4.7 v52.07,4.32 51.05,4.32 50.55,4.83 U2.2 50.55,9.54 C8.2 51.17,10.41 51.04,10.29 C6.2
  Top 0.813: U$4.PAD 43.18,28.57 v40.64,26.04 | U$4.PAD v43.18,24.13 | U$4.PAD 41.91,31.75 v41.91,24.13 | U$4.PAD 44.45,31.75 v44.45,24.13 | 43.18,36.83 v40.64,39.37 | U$4.PAD v43.18,41.91 | U$4.PAD 41.91,34.29 v41.91,41.91 | U$4.PAD 44.45,34.29 v44.45,41.91 | U$4.PAD 43.18,36.83 | 43.18,36.83 v45.72,39.37 | U$4.PAD 42.55,33.02 v39.37,36.2 | U$4.PAD 43.81,33.02 v46.99,36.2
  pour Bottom: 0,0 82.55,0 82.55,50.8 0,50.8
MISO  (via drill 0.35)
  Top 0.406: U1.16 25.66,21.33 25.65,21.34 v25.65,23.5 | J3.1 23.37,36.95 v23.37,35.56
  Bottom 0.406: v25.65,23.5 25.84,23.5 26.16,23.82 26.16,29.72 23.37,32.51 v23.37,35.56
MOSI  (via drill 0.35)
  Top 0.406: v22.23,32.38 22.23,33.02 J3.4 | U1.15 24.82,19.88 24.82,23.08 24.77,23.13 24.77,23.86 25.07,24.17 v25.07,25.4
  Bottom 0.406: v22.23,32.38 22.73,31.88 22.73,27.99 25.07,25.65 v25.07,25.4
N$2
  Top 0.406: Y1.1 15.95,22.79 16.61,22.13 U1.7
N$3
  Top 0.406: Y1.3 16.07,20.39 17.01,21.33 U1.8
N$4
  Top 0.406: U1.20 29.18,23.73 C3.1
N$5
  Top 0.406: D1.A R2.1
N$7
  Top 0.406: R3.1 31.34,20.92 D3.A
N$8
  Top 0.406: U2.4 53.1,10.27 C8.1
PB0  (via drill 0.35)
  Top 0.406: v11.43,20.95 12.39,19.99 12.39,16.73 13.68,15.44 22.14,15.44 23.16,16.47 23.16,17.59 22.46,18.3 U1.12
  Bottom 0.406: v11.43,20.95 4.12,28.27 4.12,36.11 2.54,37.68 CAMERA_GPIO.1
PB1  (via drill 0.35)
  Top 0.406: U1.13 23.37,19.72 23.37,18.36 23.88,17.85 23.88,16.9 24.52,16.26 v28.57,16.26
  Bottom 0.406: CAMERA_BOOM_MOTOR.5 41.91,48.01 39.24,45.34 39.24,41.13 37.21,39.1 37.21,38.99 35.31,37.08 30.73,37.08 29.33,35.68 29.33,20.01 28.57,19.25 v28.57,16.26
PB2  (via drill 0.35)
  Top 0.406: v37.47,29.84 U$4.8 34.94,29.84 33.78,28.68 v33.78,23.62 | v48.26,31.11 U$4.14 | U1.14 24.16,19.74 24.16,19.05 25.27,17.93 v25.27,17.27
  Bottom 0.406: v25.27,17.27 27.81,14.73 30.23,14.73 33.78,18.29 v33.78,23.62 | v37.47,29.84 46.99,29.84 v48.26,31.11
PC0
  Top 0.406: U$4.7 34.92,31.11 29.94,26.13 U1.23
PC1  (via drill 0.35)
  Top 0.406: v34.92,28.57 U$4.9 | U1.24 28.2,26.93 v31.75,30.48
  Bottom 0.406: v31.75,30.48 32.14,30.48 32.39,30.73 33.02,30.73 33.47,30.28 33.47,30.04 v34.92,28.57
PC2  (via drill 0.35)
  Top 0.406: U1.25 27.72,30.48 v30.48,30.48 | v43.81,22.23 44.45,22.23 46.35,24.13 46.35,27.29 48.91,29.84 U$4.13
  Bottom 0.406: v43.81,22.23 38.73,22.23 v30.48,30.48
PC3  (via drill 0.35)
  Top 0.406: v48.26,32.38 U$4.15 | U1.26 24.86,29.11 27.5,31.75 v31.75,31.75
  Bottom 0.406: v31.75,31.75 32.38,32.38 v48.26,32.38
PD2  (via drill 0.35)
  Top 0.406: v15.24,30.48 15.24,29.72 16.36,28.6 19.36,28.6 19.54,28.42 U1.32 | CAMERA_BOOM_MOTOR.6 38.99,42.55 v37.47,42.55
  Bottom 0.406: v15.24,30.48 16.13,31.37 16.13,33.33 16.83,34.03 18.79,34.03 21.57,36.8 21.57,39.77 24.34,42.55 24.51,42.55 27.18,39.88 35.81,39.88 37.47,41.53 v37.47,42.55
PD3  (via drill 0.35)
  Top 0.406: U1.1 18.31,27.18 12.47,27.18 v12.22,26.93 | v8.89,29.84 3.17,35.56 J1.3
  Bottom 0.406: v12.22,26.93 9.3,29.84 v8.89,29.84
PD4  (via drill 0.35)
  Top 0.406: LIMIT_SWITCHES.1 10.53,47.38 R7.1 10.53,31.38 v12.06,29.84 | U1.2 18.47,26.04 13.47,26.04 v13.21,26.3
  Bottom 0.406: v12.06,29.84 13.21,28.7 v13.21,26.3
PD5  (via drill 0.35)
  Top 0.406: LIMIT_SWITCHES.3 14.97,48.02 R6.1 14.97,44.47 12.19,41.68 12.19,37.06 13.56,35.69 15.3,35.69 17.14,33.84 v17.14,33.02 | J8.2 19.33,19.84 U1.9 20.17,19.95 20.17,20.64 20.31,20.78 20.31,22.56 20.68,22.93 20.68,24.42 20.07,25.03 20.07,26.27 v19.94,26.39
  Bottom 0.406: v17.14,33.02 19.94,30.22 v19.94,26.39
PD6  (via drill 0.35)
  Top 0.406: LIMIT_SWITCHES.5 20.05,48.02 R5.1 18.35,43.38 15.23,43.38 13.03,41.19 13.03,37.55 14.06,36.52 15.54,36.52 v19.05,33.02 | U1.10 20.95,19.93 | J8.3 20.95,19.18 20.95,19.93 | v20.95,25.4 21.34,25.02 21.34,22.65 20.97,22.29 20.97,19.95 20.95,19.93
  Bottom 0.406: v20.95,25.4 20.95,31.11 v19.05,33.02
PD7  (via drill 0.35)
  Top 0.406: LIMIT_SWITCHES.7 25.14,48.02 R4.1 24.13,44.08 v24.13,41.08 | J8.4 21.66,17.09 U1.11 21.66,22.04 22.23,22.61 v22.23,24.13
  Bottom 0.406: v22.23,24.13 v22.22,24.13 22.22,25.46 21.79,25.89 21.79,31.49 21.21,32.07 21.21,32.7 22.23,33.71 22.23,39.17 v24.13,41.08
RESET
  Top 0.406: C2.2 R1.1 19.09,27.94 19.09,27.9 19.61,27.38 22.11,27.38 22.35,27.62 22.35,28.31 U1.29 22.46,29.7 S1.3 | S1.4 S1.3 | J3.5 14.77,40.64 16.85,42.72 20.8,42.72 24.51,39.01 24.51,36.38 25.78,35.11 S1.3
RF_CTS
  Top 0.406: J5.5 U$5.P$26 U$5.P$12 73.03,26.04 58.94,11.95 47.96,11.95 47.06,11.05 47.06,9.52 48.51,8.07 J9.3
RF_MISO
  Top 0.406: U$5.P$7 U$5.P$21 J4.1
  Bottom 0.406: J4.1 53.59,14.86 J9.5
RF_MOSI
  Top 0.406: J5.3 U$5.P$24 U$5.P$10 76.76,19.76 81.33,19.76 82.12,18.97 82.12,15.57 72.47,5.92 72.47,3.38 70.08,0.99 63.48,0.99 62.99,0.51 58.8,0.51 56.44,2.87 53.04,2.87 51.44,1.27 J9.4
RF_RESET
  Top 0.406: U$5.P$2 U$5.P$16 J4.6 52.83,28.19 51.23,26.59 51.23,23.04 43.31,15.12 43.31,3.95 43.43,3.83 J9.1
RF_SCK  (via drill 0.35)
  Top 0.406: J5.4 U$5.P$25 U$5.P$11 76.76,24.69 81.08,24.69 82.12,25.73 82.12,31.42 81.08,32.46 79.96,32.46 79.17,31.67 79.17,30.46 78.32,29.62 74.92,29.62 57.92,12.61 47.41,12.61 v45.97,11.18
  Bottom 0.406: v45.97,11.18 J9.2
RXI  (via drill 0.35)
  Top 0.406: U1.30 21.55,28.54 21.55,29.36 20.53,30.37 18.18,30.37 17.29,29.49 v17.02,29.49 | v10.98,22.66 6.15,22.66 J2.TXO
  Bottom 0.406: v17.02,29.49 14.1,26.57 14.1,25.93 12.93,24.76 12.08,24.76 10.98,23.66 v10.98,22.66
SCK  (via drill 0.35)
  Top 0.406: U1.17 29.2,21.33 R3.2 29.07,20.45 v28.45,20.45 | v23.11,38.73 23.11,39.33 20.46,41.99 19.13,41.99 17.78,40.64 J3.3
  Bottom 0.406: v23.11,38.73 28.57,33.27 28.57,20.57 v28.45,20.45
SCL  (via drill 0.35)
  Top 0.406: J7.2 U$2.PIN2 34.27,7.59 26.57,7.59 v22.23,11.94 | U1.28 23.26,24.89 23.25,24.88 23.25,22.18 v22.87,21.8
  Bottom 0.406: v22.87,21.8 22.87,17.64 22.94,17.58 22.94,12.65 v22.23,11.94
SDA  (via drill 0.35)
  Top 0.406: U1.27 24.14,28.35 v24.14,24.51 | v33.02,12.42 33.02,9.35 U$2.PIN3
  Bottom 0.406: v24.14,24.51 24.14,14.6 26.06,12.67 32.77,12.67 v33.02,12.42 | U$2.PIN3 32.56,3 J7.3
TXO  (via drill 0.35)
  Top 0.406: U1.31 20.75,28.54 20.75,29.23 20.48,29.49 v18.54,29.49 | v12.45,23.88 4.83,23.88 J2.RXI
  Bottom 0.406: v18.54,29.49 18.54,28.73 13.69,23.88 v12.45,23.88
VCC
  pour Top: 0,0 82.55,0 82.55,50.8 0,50.8

### Text on the board
tPlace: D4 | 5V | D5 | 5V | D6 | 5V | D7 | 5V | M+ | M- | G | 5V | E1 | E2 | M+ | M- | G | GND | RST | MOSI | SCK | 5V | MISO | D8 | CSM Rocksat-X Boom Board / Rev2 01/28/2020 / Graham Braly & Mark Gilliland | D3 | 5V | GND | G | D5 | D6 | D7 | 5VD | 5VA | GND | 12V | SDA | SCL | GND | G | 3.3
tNames: D13 | Power
tDocu: A B